# Altium schematic sheet Arduino connecions.SchDoc
size A4
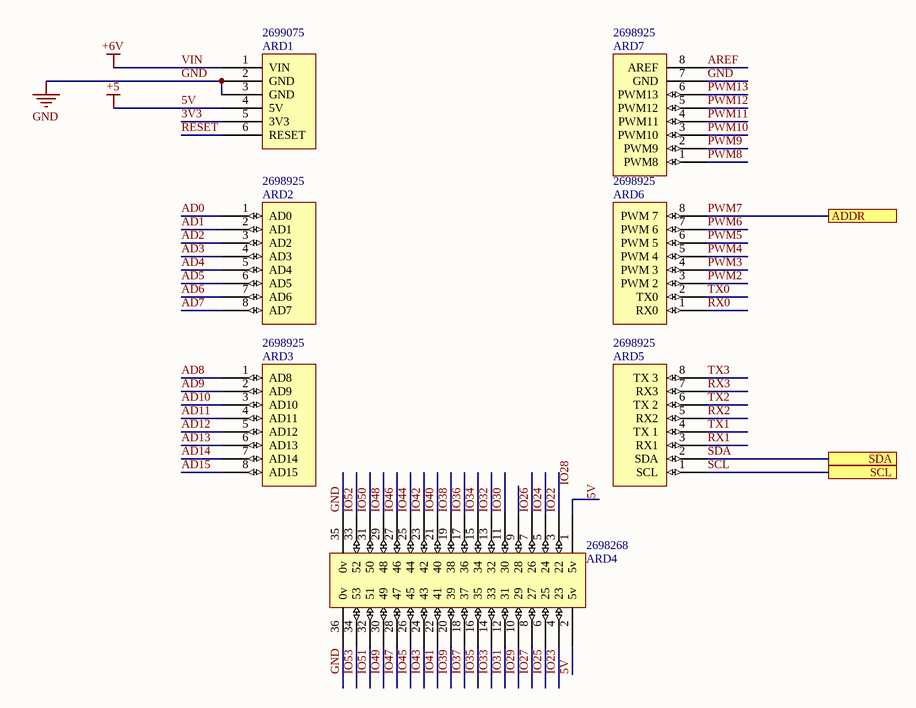
[diagram p0: Arduino connecions.SchDoc]

## Parts
ARD1  Supplier Part Number 2: 2699075  [Header 6x1 8.5mm]
ARD2  Supplier Part Number 5: 2698925  [Header 8x1 8.5mm]  (hidden comment: AD_L)
ARD3  Supplier Part Number 4: 2698925  [Header 8x1 8.5mm]  (hidden comment: AD_H)
ARD4  Supplier Part Number 5: 2698268  [HEADER 36X 8MM]  (hidden comment: IO_36)
ARD5  Supplier Part Number 4: 2698925  [Header 8x1 8.5mm]  (hidden comment: Communication)
ARD6  Supplier Part Number 4: 2698925  [Header 8x1 8.5mm]  (hidden comment: PWM_L)
ARD7  Supplier Part Number 4: 2698925  [Header 8x1 8.5mm]  (hidden comment: PWM_H)

## Ports
ADDR, SCL, SDA

## Nets
5V: ARD1.4(5V) ARD4.1(5v) ARD4.2(5v)  [also labelled +5]
GND: ARD1.2(GND) ARD1.3(GND) ARD4.35(0v) ARD4.36(0v) ARD7.7(GND)
VIN: ARD1.1(VIN)  [also labelled +6V]
3V3: ARD1.5(3V3)
AD0: ARD2.1(AD0)
AD1: ARD2.2(AD1)
AD2: ARD2.3(AD2)
AD3: ARD2.4(AD3)
AD4: ARD2.5(AD4)
AD5: ARD2.6(AD5)
AD6: ARD2.7(AD6)
AD7: ARD2.8(AD7)
AD8: ARD3.1(AD8)
AD9: ARD3.2(AD9)
AD10: ARD3.3(AD10)
AD11: ARD3.4(AD11)
AD12: ARD3.5(AD12)
AD13: ARD3.6(AD13)
AD14: ARD3.7(AD14)
AD15: ARD3.8(AD15)
AREF: ARD7.8(AREF)
IO22: ARD4.3(22)
IO23: ARD4.4(23)
IO24: ARD4.5(24)
IO25: ARD4.6(25)
IO26: ARD4.7(26)
IO27: ARD4.8(27)
IO29: ARD4.10(29)
IO30: ARD4.11(30)
IO31: ARD4.12(31)
IO32: ARD4.13(32)
IO33: ARD4.14(33)
IO34: ARD4.15(34)
IO35: ARD4.16(35)
IO36: ARD4.17(36)
IO37: ARD4.18(37)
IO38: ARD4.19(38)
IO39: ARD4.20(39)
IO40: ARD4.21(40)
IO41: ARD4.22(41)
IO42: ARD4.23(42)
IO43: ARD4.24(43)
IO44: ARD4.25(44)
IO45: ARD4.26(45)
IO46: ARD4.27(46)
IO47: ARD4.28(47)
IO48: ARD4.29(48)
IO49: ARD4.30(49)
IO50: ARD4.31(50)
IO51: ARD4.32(51)
IO52: ARD4.33(52)
IO53: ARD4.34(53)
PWM2: ARD6.3(PWM_2)
PWM3: ARD6.4(PWM_3)
PWM4: ARD6.5(PWM_4)
PWM5: ARD6.6(PWM_5)
PWM6: ARD6.7(PWM_6)
PWM7: ARD6.8(PWM_7) ; port ADDR
PWM8: ARD7.1(PWM8)
PWM9: ARD7.2(PWM9)
PWM10: ARD7.3(PWM10)
PWM11: ARD7.4(PWM11)
PWM12: ARD7.5(PWM12)
PWM13: ARD7.6(PWM13)
RESET: ARD1.6(RESET)
RX0: ARD6.1(RX0)
RX1: ARD5.3(RX1)
RX2: ARD5.5(RX2)
RX3: ARD5.7(RX3)
SCL: ARD5.1(SCL) ; port SCL
SDA: ARD5.2(SDA) ; port SDA
TX0: ARD6.2(TX0)
TX1: ARD5.4(TX_1)
TX2: ARD5.6(TX_2)
TX3: ARD5.8(TX_3)

Not connected (* = marked no-connect by the designer): ARD4 9(28)

## Notes on the sheet
- Labels drawn without touching a wire or pin: IO28

## Library data of the parts
ARD1 = POWER: Supplier 1: Arrow; Supplier Part Number 1: 52553843; Supplier 2: Arrow; Supplier 3: Digi-Key; Supplier Part Number 3: SAM1198-06-ND; Supplier 4: Arrow; Supplier Part Number 4: 2699089; Supplier 5: Arrow; Supplier Part Number 5: 2699088
ARD2 = AD_L: Supplier 1: Digi-Key; Supplier Part Number 1: SAM1198-08-ND; Supplier 2: Arrow; Supplier Part Number 2: 2698939; Supplier 3: Arrow; Supplier Part Number 3: 2698940; Supplier 4: Arrow; Supplier Part Number 4: 43085273; Supplier 5: Arrow
ARD3 = AD_H: Supplier 1: Arrow; Supplier Part Number 1: 2698940; Supplier 2: Arrow; Supplier Part Number 2: 2698939; Supplier 3: Digi-Key; Supplier Part Number 3: SAM1198-08-ND; Supplier 4: Arrow
ARD4 = IO_36: Supplier 1: Digi-Key; Supplier Part Number 1: SAM1196-18-ND; Supplier 2: Arrow; Supplier Part Number 2: 48117090; Supplier 3: Arrow; Supplier Part Number 3: 46093326; Supplier 4: Arrow; Supplier Part Number 4: 2698278; Supplier 5: Arrow
ARD5 = Communication: Supplier 1: Digi-Key; Supplier Part Number 1: SAM1198-08-ND; Supplier 2: Arrow; Supplier Part Number 2: 2698940; Supplier 3: Arrow; Supplier Part Number 3: 2698939; Supplier 4: Arrow
ARD6 = PWM_L: Supplier 1: Arrow; Supplier Part Number 1: 2698940; Supplier 2: Arrow; Supplier Part Number 2: 2698939; Supplier 3: Digi-Key; Supplier Part Number 3: SAM1198-08-ND; Supplier 4: Arrow
ARD7 = PWM_H: Supplier 1: Digi-Key; Supplier Part Number 1: SAM1198-08-ND; Supplier 2: Arrow; Supplier Part Number 2: 2698940; Supplier 3: Arrow; Supplier Part Number 3: 2698939; Supplier 4: Arrow